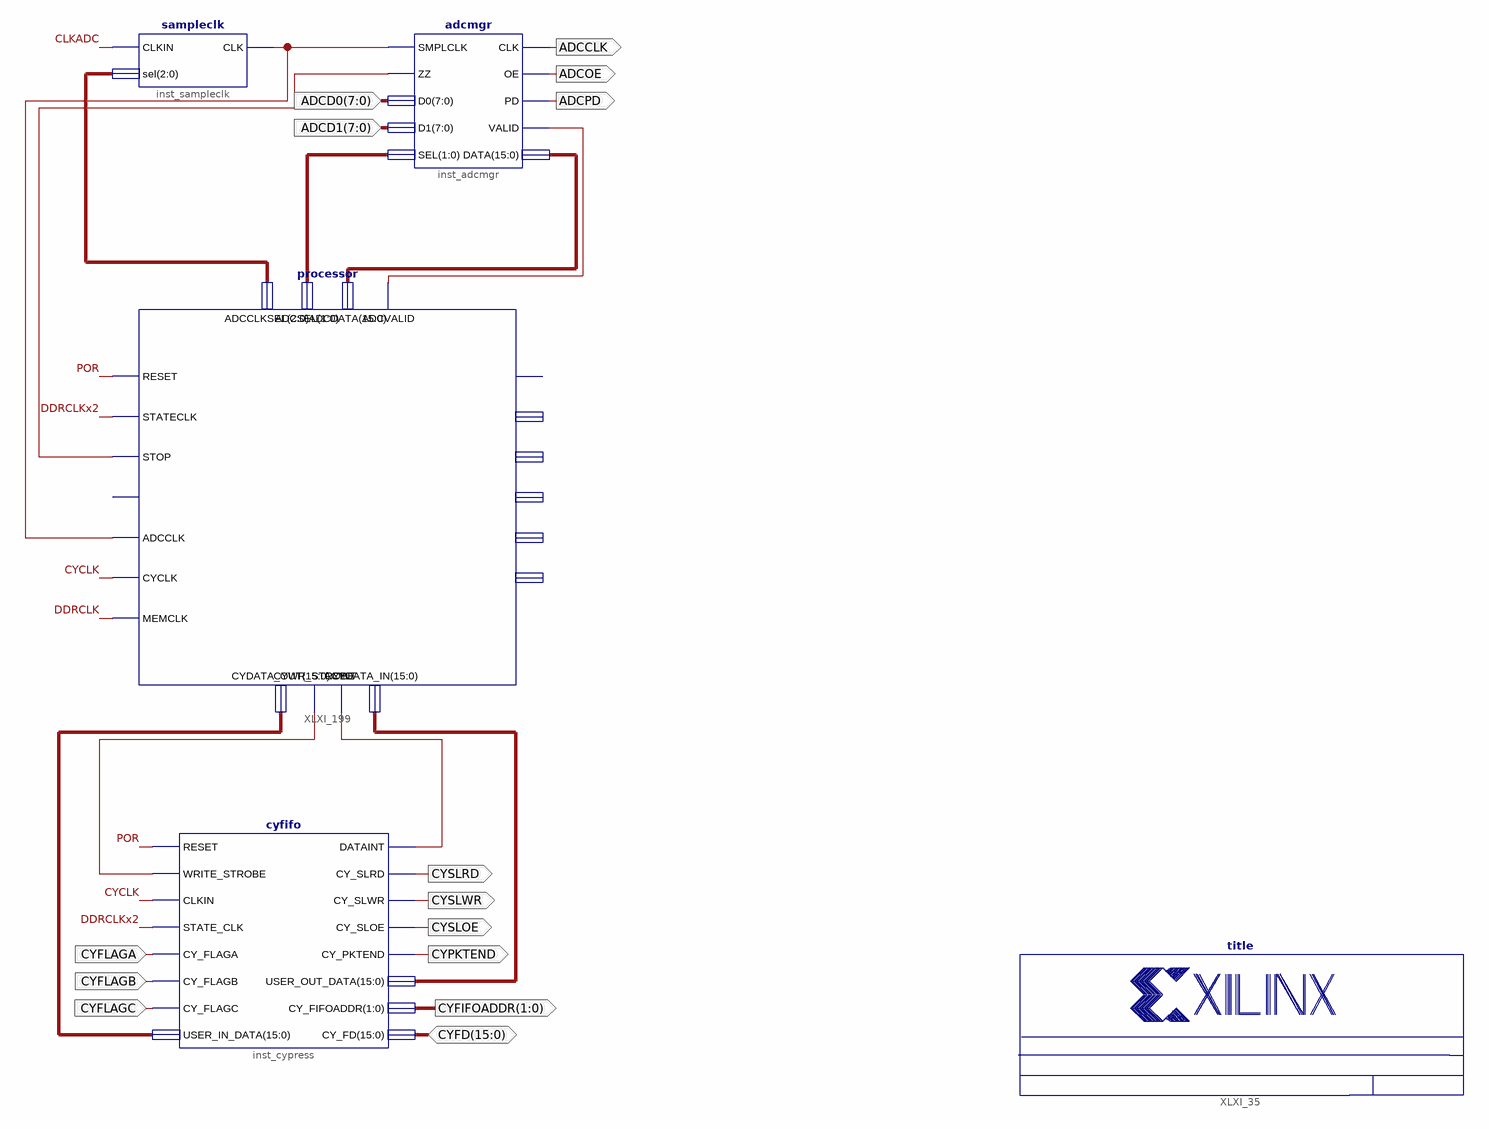
[diagram p0: schematic sheet 1]
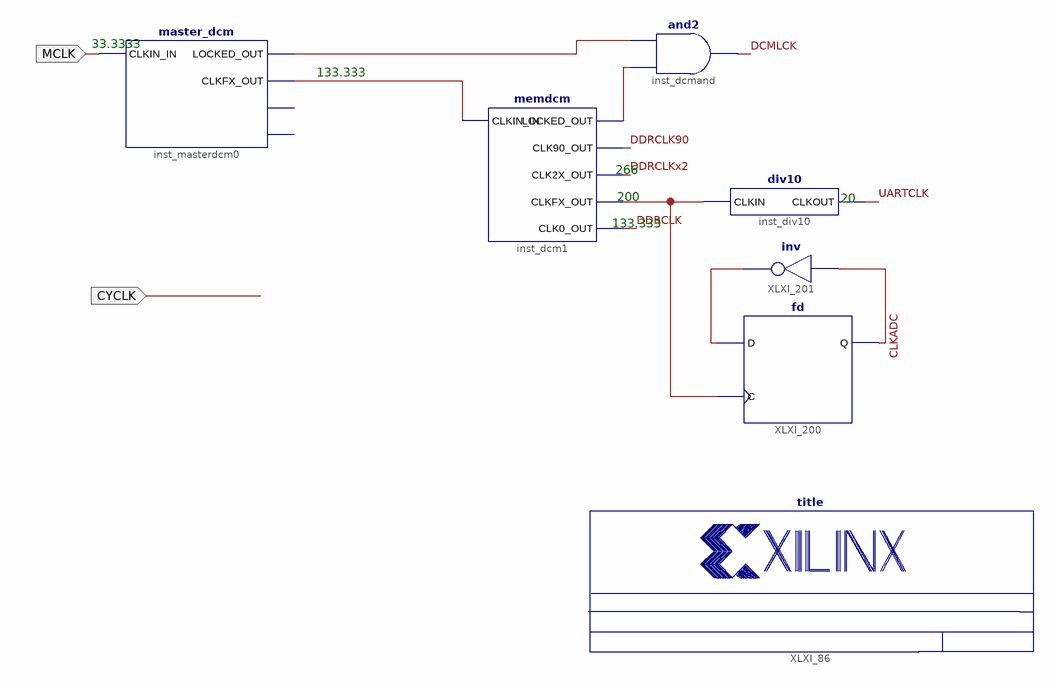
[diagram p1: schematic sheet 2]
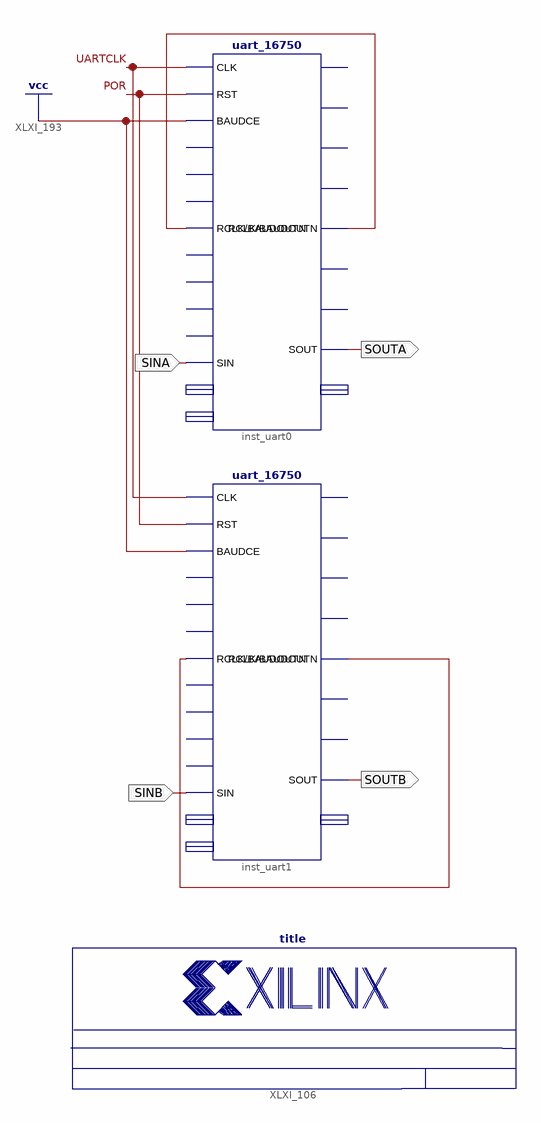
[diagram p2: schematic sheet 3]
// Xilinx ISE schematic main.sch (spartan3a) as structural Verilog: 15 symbols, 20 ports
module main (
  input  SINA,
  input  SINB,
  input  MCLK,
  input  CYFLAGC,
  input  CYFLAGB,
  input  CYFLAGA,
  input  CYCLK,
  input  [7:0] ADCD1,
  input  [7:0] ADCD0,
  inout  [15:0] CYFD,
  output SOUTA,
  output SOUTB,
  output CYSLRD,
  output CYSLOE,
  output CYSLWR,
  output CYPKTEND,
  output [1:0] CYFIFOADDR,
  output ADCOE,
  output ADCPD,
  output ADCCLK
);

  wire CLKADC, CLKADCx2, DCMLCK, DDRCLK, DDRCLK90, DDRCLKx2, POR, UARTCLK, XLXN_449, XLXN_551, XLXN_552,
       XLXN_675, XLXN_679, XLXN_754, XLXN_755, XLXN_761, XLXN_767, XLXN_770, XLXN_830;
  wire [1:0] XLXN_807;
  wire [2:0] XLXN_688;
  wire [15:0] XLXN_676, XLXN_680, XLXN_806;

  title #(.TitleFieldText("USB Scope"), .NameFieldText("(C) Ali Lown 2010-11")) XLXI_35 ();
  title #(.TitleFieldText("USB Scope"), .NameFieldText("(C) Ali Lown 2010")) XLXI_86 ();
  title #(.TitleFieldText("USB Scope"), .NameFieldText("(C) Ali Lown 2010")) XLXI_106 ();
  uart_16750 inst_uart0 (
    .CLK(UARTCLK), .RST(POR), .BAUDCE(1'b1), .RCLK(XLXN_551), .SIN(SINA), .BAUDOUTN(XLXN_551), .SOUT(SOUTA));  // open: CS, WR, RD, CTSN, DSRN, DCDN, RIN, A, DIN, DDIS, INT, OUT1N, OUT2N, RTSN, DTRN, DOUT
  uart_16750 inst_uart1 (
    .CLK(UARTCLK), .RST(POR), .BAUDCE(1'b1), .RCLK(XLXN_552), .SIN(SINB), .BAUDOUTN(XLXN_552), .SOUT(SOUTB));  // open: CS, WR, RD, CTSN, DSRN, DCDN, RIN, A, DIN, DDIS, INT, OUT1N, OUT2N, RTSN, DTRN, DOUT
  and inst_dcmand (DCMLCK, XLXN_449, XLXN_754);
  div10 inst_div10 (.CLKIN(CLKADCx2), .CLKOUT(UARTCLK));
  memdcm inst_dcm1 (
    .CLKIN_IN(XLXN_755), .LOCKED_OUT(XLXN_449), .CLK90_OUT(DDRCLK90), .CLK2X_OUT(DDRCLKx2),
    .CLKFX_OUT(CLKADCx2), .CLK0_OUT(DDRCLK));
  processor XLXI_199 (
    .ADCCLK(XLXN_767), .CYCLK(CYCLK), .MEMCLK(DDRCLK), .RESET(POR), .STATECLK(DDRCLKx2), .STOP(XLXN_770),
    .CYWR_STROBE(XLXN_675), .CYDATA_OUT(XLXN_676), .ADCCLKSEL(XLXN_688), .ADCDATA(XLXN_806),
    .ADCSEL(XLXN_807), .ADCVALID(XLXN_830), .CYINT(XLXN_679), .CYDATA_IN(XLXN_680));  // open: MEMADDR, MEMCTRL, MEMDATAMASK, MEMDATA_IN, MEMDATA_OUT, MEMDONE, STOPPED
  cyfifo inst_cypress (
    .RESET(POR), .WRITE_STROBE(XLXN_675), .CLKIN(CYCLK), .STATE_CLK(DDRCLKx2), .CY_FLAGA(CYFLAGA),
    .CY_FLAGB(CYFLAGB), .CY_FLAGC(CYFLAGC), .USER_IN_DATA(XLXN_676), .DATAINT(XLXN_679), .CY_SLRD(CYSLRD),
    .CY_SLWR(CYSLWR), .CY_SLOE(CYSLOE), .CY_PKTEND(CYPKTEND), .USER_OUT_DATA(XLXN_680),
    .CY_FIFOADDR(CYFIFOADDR), .CY_FD(CYFD));
  sampleclk inst_sampleclk (.CLKIN(CLKADC), .sel(XLXN_688), .CLK(XLXN_767));
  master_dcm inst_masterdcm0 (
    .CLKIN_IN(MCLK), .LOCKED_OUT(XLXN_754), .CLKFX_OUT(XLXN_755));  // open: CLKIN_IBUFG_OUT, CLK0_OUT
  fd XLXI_200 (.C(CLKADCx2), .D(XLXN_761), .Q(CLKADC));
  not XLXI_201 (XLXN_761, CLKADC);
  adcmgr inst_adcmgr (
    .SMPLCLK(XLXN_767), .ZZ(XLXN_770), .D0(ADCD0), .D1(ADCD1), .SEL(XLXN_807), .CLK(ADCCLK), .OE(ADCOE),
    .PD(ADCPD), .VALID(XLXN_830), .DATA(XLXN_806));

  // Notes on the sheet:
  //   33.3333
  //   133.333
  //   266
  //   200
  //   20
  //   133.333
endmodule
